# Altium schematic sheet USB.SchDoc
size 254 x 177 mm; SheetNumber: 1; SheetTotal: 3
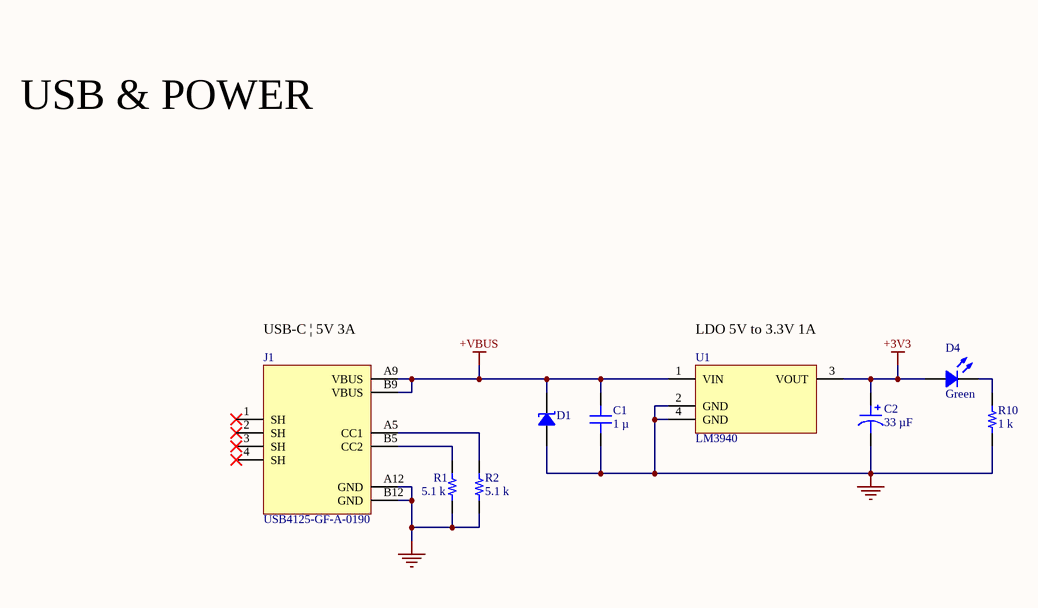
[diagram p0: USB.SchDoc]

## Parts
C1  1 µ  [CAP 0603_1608]
C2  33 µF  [CAP POL 1411_3528]
D1  VTVS5V0ASMF-M3-08  [SMF DO-219AB]  (value not drawn)
D4  Green  [LED 0603_1608 GREEN]
J1  USB4125-GF-A-0190  [FP-USB4125-GF-A-0190-MFG]
R1  5.1 k  [RES 0603_1608]
R2  5.1 k  [RES 0603_1608]
R10  1 k  [RES 0603_1608]
U1  LM3940  [FP-DCY0004A-IPC_C]

## Nets
+3V3: C2.1 D4.1 U1.3(VOUT)
+VBUS: C1.2 D1.2 J1.A9(VBUS) J1.B9(VBUS) U1.1(VIN)
GND: C1.1 C2.2 D1.1 J1.A12(GND) J1.B12(GND) R1.1 R2.1 R10.2 U1.2(GND) U1.4(GND)
NetD4_2: D4.2 R10.1
NetJ1_A5: J1.A5(CC1) R2.2
NetJ1_B5: J1.B5(CC2) R1.2

Not connected (* = marked no-connect by the designer): J1 1(SH)* 2(SH)* 3(SH)* 4(SH)*

## Notes on the sheet
- USB & POWER
- (near J1) USB-C | 5V 3A
- (near U1) LDO 5V to 3.3V 1A

## Library data of the parts
C1 = C0603C105K4RACAUTO: CAP CER 1UF 16V X7R 0603; manufacturer: KEMET; Capacitance: 1 µF; Tolerance: ±10%; Part Number: C0603C105K4RACAUTO; Value: 1 µ; Applications: Automotive, Bypass, Decoupling; componentlink1description: Datasheet; componentlink1url: https://api.kemet.com/component-edge/download/datasheet/C0603C105K4RACAUTO.pdf; componentlink2description: DigiKey Link; componentlink2url: https://www.digikey.com/en/products/detail/kemet/C0603C105K4RACAUTO/8635831; Device Package: 0603 (1608 Metric); lastupdated: 2/9/2024 8:10:30 PM; Lifecycle Status: Active; Minimum Order: 1; Mounting Type: Surface Mount, MLCC; Operating Temperature: -55°C ~ 125°C; Package / Case: 0603 (1608 Metric); packaging: TapeAndReel; partid: 2179; Part Status: Active; price: 0.01; Ratings: AEC-Q200; series: SMD Auto X7R; Size / Dimension: 0.063" L x 0.031" W (1.60mm x 0.80mm); Supplier 1: DigiKey; Supplier Part Number 1: 399-17704-1-ND; Temperature Coefficient: X7R; Thickness (Max): 0.037" (0.95mm); Voltage - Rated: 16V
C2 = T495B336M016ATE350: CAP TANT 33UF 20% 16V 1411; manufacturer: KEMET; Manufacturer Size Code: B; ESR (Equivalent Series Resistance): 350mOhm @ 100kHz; Lifetime @ Temp.: 2000 Hrs @ 125°C; Type: Molded; Part Number: T495B336M016ATE350; Value: 33 µF; Capacitance: 33 µF; componentlink1description: Datasheet; componentlink1url: https://api.kemet.com/component-edge/download/datasheet/T495B336M016ATE350.pdf; componentlink2description: DigiKey Link; componentlink2url: https://www.digikey.com/en/products/detail/kemet/T495B336M016ATE350/9642234; Device Package: 1411 (3528 Metric); Features: General Purpose; Height - Seated (Max): 0.083" (2.10mm); lastupdated: 3/11/2024 7:26:10 AM; Lifecycle Status: Active; Minimum Order: 1; Mounting Type: Surface Mount; Operating Temperature: -55°C ~ 125°C; Package / Case: 1411 (3528 Metric); packaging: TapeAndReel; partid: 33; Part Status: Active; price: 0.64; series: T495; Size / Dimension: 0.138" L x 0.110" W (3.50mm x 2.80mm); Supplier 1: DigiKey; Supplier Part Number 1: 399-18820-1-ND; Tolerance: ±20%; Voltage - Rated: 16 V
D1 = VTVS5V0ASMF-M3-08: TVS DIODE 5V 8.9V DO219AB; Manufacturer: Vishay Semiconductor Diodes Division; Capacitance @ Frequency: 2095pF @ 1MHz; Current - Peak Pulse (10/1000µs): 42.95A; Power Line Protection: No; Power - Peak Pulse: 400W; Type: Zener; Unidirectional Channels: 1; Voltage - Breakdown (Min): 6.4V; Part Number: VTVS5V0ASMF-M3-08; Applications: General Purpose; ComponentLink1Description: Datasheet; ComponentLink1URL: http://www.vishay.com/docs/85891/vtvs3v3asmf.pdf; ComponentLink2Description: DigiKey Link; ComponentLink2URL: http://digikey.com/product-detail/en/vishay-semiconductor-diodes-division/VTVS5V0ASMF-M3-08/VTVS5V0ASMF-M3-08GICT-ND/7056003; LastUpdated: 3/11/2024 8:09:28 AM; Lifecycle Status: Active; Minimum Order: 1; Mounting Type: Surface Mount; Operating Temperature: -55°C ~ 175°C (TJ); Package / Case: DO-219AB; Packaging: TapeAndReel; PartId: 5492; Part Status: Active; Price: 0.11; Series: TransZorb®; Supplier 1: DigiKey; Supplier Part Number 1: VTVS5V0ASMF-M3-08GICT-ND; Supplier Device Package: DO-219AB (SMF); Voltage - Clamping (Max) @ Ipp: 8.9V; Voltage - Reverse Standoff (Typ): 5V
D4 = SML-LXFP0603SUGCTR: LED GREEN CLEAR SMD; Manufacturer: Lumex Opto/Components Inc.; Configuration: Standard; Current - Test: 5mA; Lens Color: Colorless; Lens Size: 1.60mm x 0.80mm; Lens Style: Rectangle with Flat Top; Millicandela Rating: 13mcd; Viewing Angle: 130°; Voltage - Forward (Vf) (Typ): 2V; Wavelength - Peak: 574nm; Part Number: SML-LXFP0603SUGCTR; Color: Green; ComponentLink1Description: Datasheet; ComponentLink1URL: https://www.lumex.com/content/files/ProductAttachment/SML-LXFP0603SUGCTR.pdf; ComponentLink2Description: DigiKey Link; ComponentLink2URL: https://www.digikey.com/en/products/detail/lumex-opto-components-inc/SML-LXFP0603SUGCTR/4496766; Device Package: 0603 (1608 Metric); Height (Max): 0.20mm; LastUpdated: 3/11/2024 7:51:11 AM; Lens Transparency: Clear; Lifecycle Status: Active; Minimum Order: 1; Mounting Type: Surface Mount; Package / Case: 0603 (1608 Metric); Packaging: TapeAndReel; PartId: 589; Part Status: Active; Price: 0.07; Series: -; Size / Dimension: 1.60mm L x 0.80mm W; Supplier 1: DigiKey; Supplier Part Number 1: 67-2222-1-ND; Supplier Device Package: SMD; Value: Green
J1 = CMP-002-00081-2: USB-C (USB TYPE-C) Receptacle Connector 24 (6+18 Dummy) Position Surface Mount, Right Angle; Through Hole; Max Current Rating: 3A; Voltage Rating: 20V; Min Operating Temperature: -30°C; Pins: 24 (6+18 Dummy); Max Operating Temperature: 85°C; Gender: Receptacle; Connector Type: USB-C (USB TYPE-C); Manufacturer Part #: USB4125-GF-A; Mounting Technology: Surface Mount, Right Angle; Through Hole
R1 R2 = RMCF0603JG5K10: RES 5.1K OHM 5% 1/10W 0603; Manufacturer: Stackpole Electronics Inc; Power (Watts): 0.1W, 1/10W; Resistance: 5.1 kOhms; Temperature Coefficient: ±200ppm/°C; Part Number: RMCF0603JG5K10; Value: 5.1 k; ComponentLink1Description: Datasheet; ComponentLink1URL: https://www.seielect.com/catalog/sei-packaging.pdf; ComponentLink2Description: DigiKey Link; ComponentLink2URL: https://www.digikey.com/en/products/detail/stackpole-electronics-inc/RMCF0603JG5K10/1712287; Composition: Thick Film; Device Package: 0603 (1608 Metric); Features: Automotive AEC-Q200; Height - Seated (Max): 0.022" (0.55mm); LastUpdated: 2/9/2024 8:43:35 PM; Lifecycle Status: Active; Minimum Order: 1; Number of Terminations: 2; Operating Temperature: -55°C ~ 155°C; Package / Case: 0603 (1608 Metric); Packaging: CutTape; PartId: 5180; Part Status: Active; Price: 0.01; Ratings: AEC-Q200; Series: RMCF; Size / Dimension: 0.061" L x 0.031" W (1.55mm x 0.80mm); Supplier 1: DigiKey; Supplier Part Number 1: 738-RMCF0603JG5K10CT-ND; Supplier Device Package: 0603; Tolerance: ±5%
R10 = CPF0603B1K0E: RES SMD 1K OHM 0.1% 1/16W 0603; Manufacturer: TE Connectivity Passive Product; Power (Watts): 0.063W, 1/16W; Resistance: 1 kOhms; Temperature Coefficient: ±25ppm/°C; Part Number: CPF0603B1K0E; Value: 1 k; ComponentLink1Description: Datasheet; ComponentLink1URL: https://www.te.com/commerce/DocumentDelivery/DDEController?Action=srchrtrv&DocNm=1773200&DocType=DS&DocLang=English; ComponentLink2Description: DigiKey Link; ComponentLink2URL: https://www.digikey.com/en/products/detail/te-connectivity-passive-product/CPF0603B1K0E/2390473; Composition: Thin Film; Device Package: 0603 (1608 Metric); Height - Seated (Max): 0.022" (0.55mm); LastUpdated: 2/9/2024 8:43:37 PM; Lifecycle Status: Active; Minimum Order: 1; Number of Terminations: 2; Operating Temperature: -55°C ~ 155°C; Package / Case: 0603 (1608 Metric); Packaging: TapeAndReel; PartId: 4877; Part Status: Active; Price: 0.09; Series: CPF, Neohm; Size / Dimension: 0.061" L x 0.031" W (1.55mm x 0.80mm); Supplier 1: DigiKey; Supplier Part Number 1: A119887CT-ND; Supplier Device Package: 0603; Tolerance: ±0.1%
U1 = CMP-019-00049-4: IC REG LDO 3.3V 1A SOT223